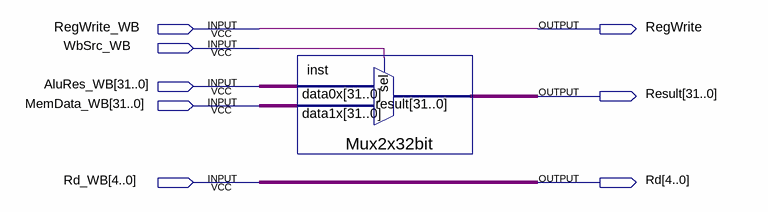
[diagram p0: schematic sheet]
// Quartus schematic Writeback.bdf as structural Verilog: 1 symbols, 8 pins
module Writeback (
  input  RegWrite_WB,
  input  WbSrc_WB,
  input  [31:0] AluRes_WB,
  input  [31:0] MemData_WB,
  input  [4:0] Rd_WB,
  output RegWrite,
  output [31:0] Result,
  output [4:0] Rd
);

  Mux2x32bit inst (.data1x(MemData_WB), .data0x(AluRes_WB), .sel(WbSrc_WB), .result(Result));

  assign Rd = Rd_WB;
  assign RegWrite = RegWrite_WB;
endmodule
